# EAGLE design AJH_ss12144_01_4hp (EAGLE 9.5.2)
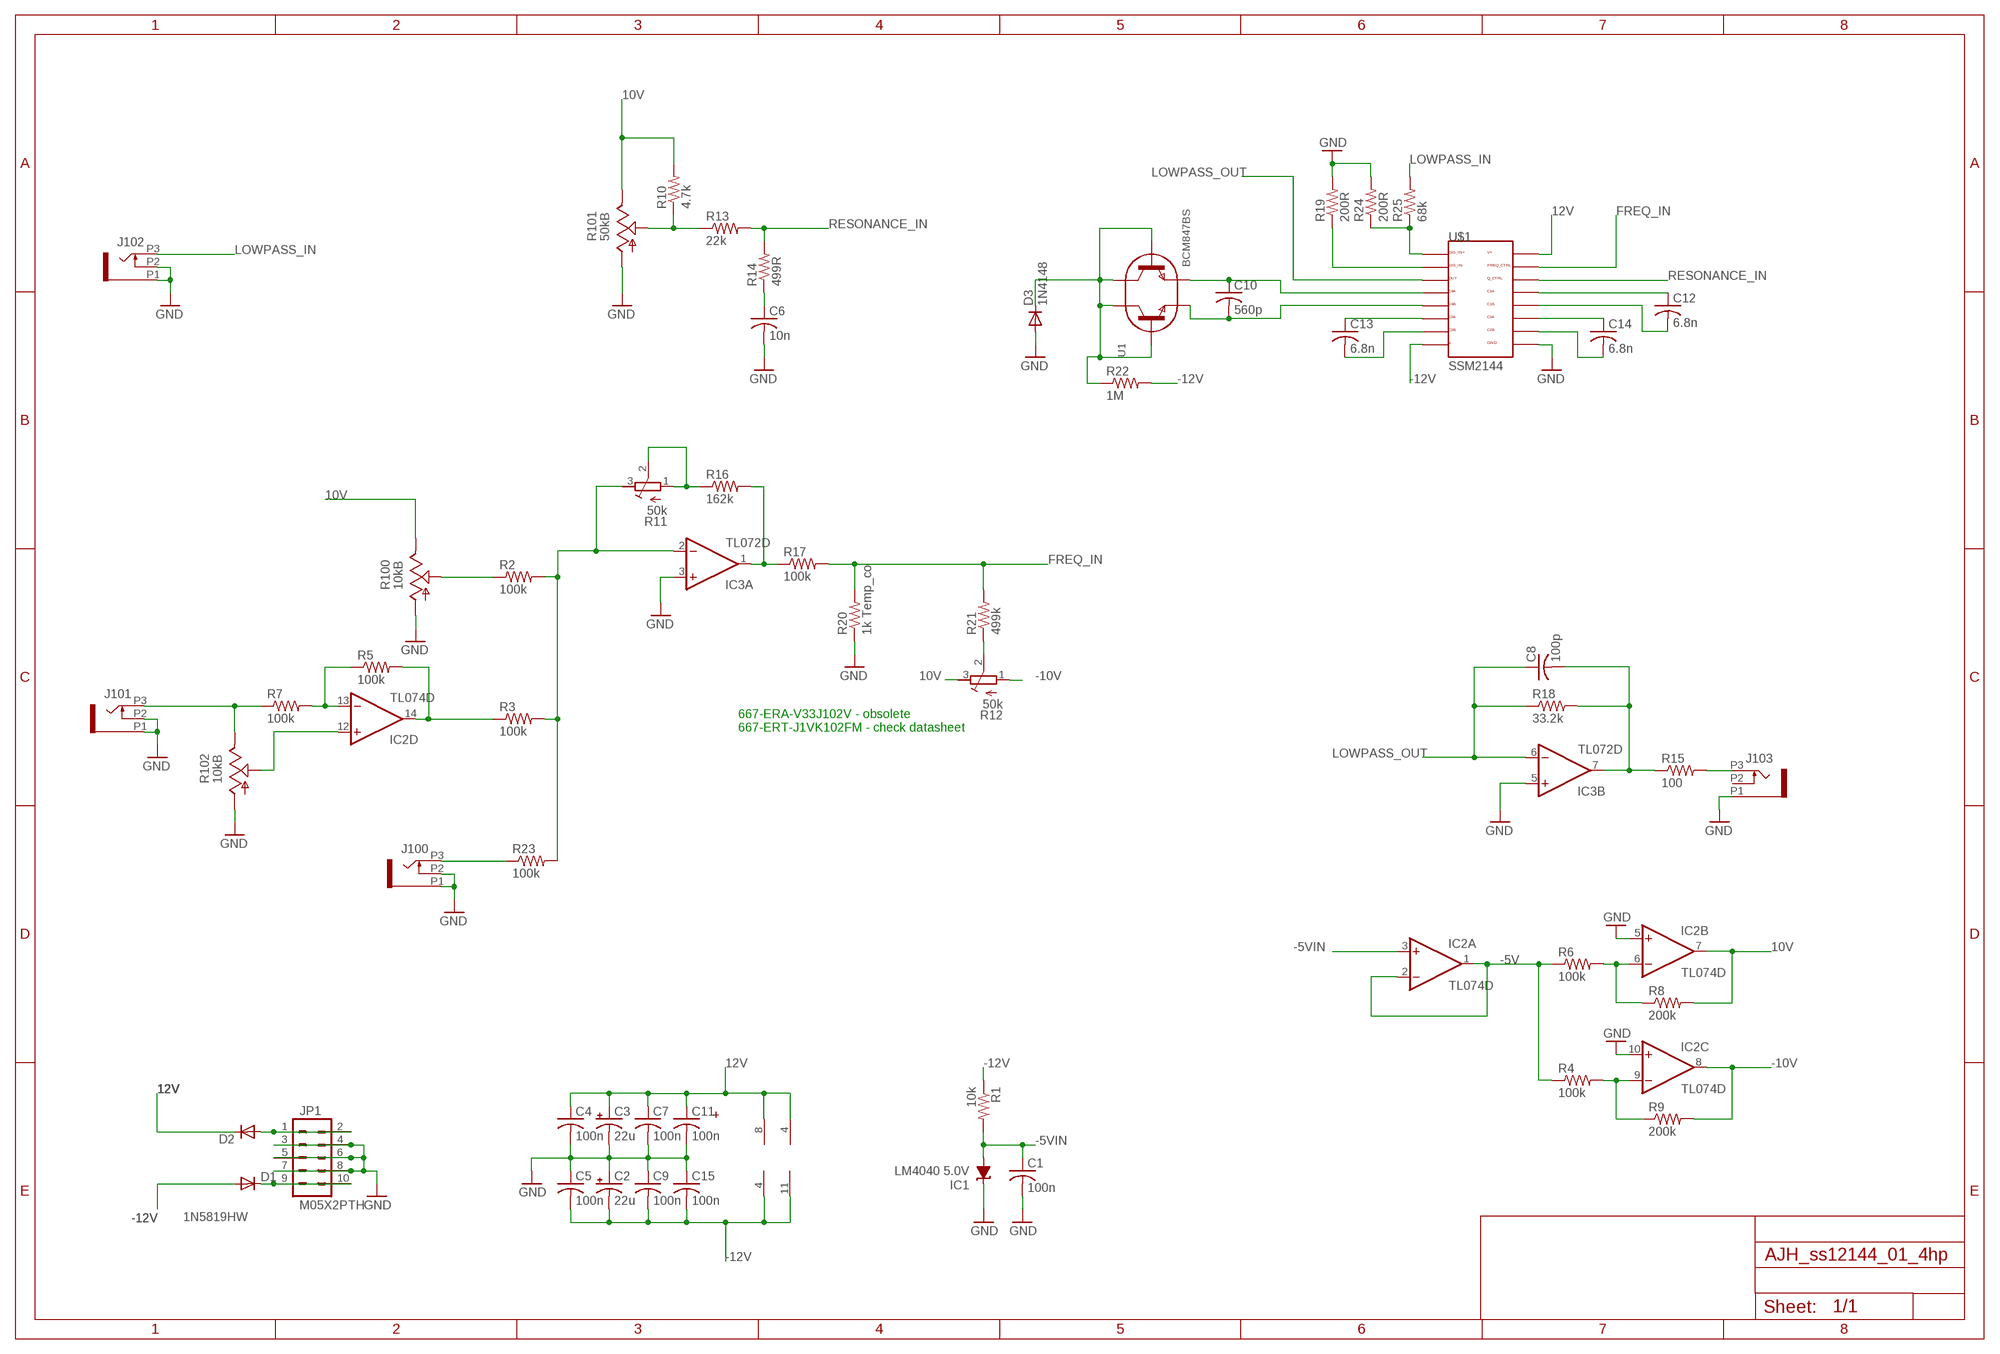
[diagram p0: schematic, sheet 1]

## Parts
C1  100n  C-USC0603  [C0603]
C2  22u  CPOL-USB  [PANASONIC_B]
C3  22u  CPOL-USB  [PANASONIC_B]
C4  100n  C-USC0603  [C0603]
C5  100n  C-USC0603  [C0603]
C6  10n  C-USC0603  [C0603]
C7  100n  C-USC0603  [C0603]
C8  100p  C-USC0603  [C0603]
C9  100n  C-USC0603  [C0603]
C10  560p  C-USC0603  [C0603]
C11  100n  C-USC0603  [C0603]
C12  6.8n  C-USC0603  [C0603]
C13  6.8n  C-USC0603  [C0603]
C14  6.8n  C-USC0603  [C0603]
C15  100n  C-USC0603  [C0603]
D1  1N5819HW  DIODE-SOD123  [SOD123]
D2  1N5819HW  DIODE-SOD123  [SOD123]
D3  1N4148  DIODE-SOD523  [SOD523]
IC1  LM4040 5.0V  LM4041C12DBZ  [DBZ_R-PDSO-G3]
IC2  TL074D  [SO14]
IC3  TL072D  [SO08]
J100  PJ301_THONKICONN6  [WQP_PJ_301M6]
J101  PJ301_THONKICONN6  [WQP_PJ_301M6]
J102  PJ301_THONKICONN6  [WQP_PJ_301M6]
J103  PJ301_THONKICONN6  [WQP_PJ_301M6]
JP1  M05X2PTH  [AVR_ICSP]
R1  10k  R-US_R0603  [R0603]
R2  100k  R-US_R0603  [R0603]
R3  100k  R-US_R0603  [R0603]
R4  100k  R-US_R0603  [R0603]
R5  100k  R-US_R0603  [R0603]
R6  100k  R-US_R0603  [R0603]
R7  100k  R-US_R0603  [R0603]
R8  200k  R-US_R0603  [R0603]
R9  200k  R-US_R0603  [R0603]
R10  4.7k  R-US_R0603  [R0603]
R11  50k  R-TRIMM3296X  [RTRIM3296X]
R12  50k  R-TRIMM3296X  [RTRIM3296X]
R13  22k  R-US_R0603  [R0603]
R14  499R  R-US_R0603  [R0603]
R15  100  R-US_R0603  [R0603]
R16  162k  R-US_R0603  [R0603]
R17  100k  R-US_R0603  [R0603]
R18  33.2k  R-US_R0603  [R0603]
R19  200R  R-US_R0603  [R0603]
R20  1k Temp_co  R-US_R0603  [R0603]
R21  499k  R-US_R0603  [R0603]
R22  1M  R-US_R0603  [R0603]
R23  100k  R-US_R0603  [R0603]
R24  200R  R-US_R0603  [R0603]
R25  68k  R-US_R0603  [R0603]
R100  10kB  POT_USVERTICAL  [ALPS_POT_VERTICAL]
R101  50kB  POT_USVERTICAL  [ALPS_POT_VERTICAL]
R102  10kB  POT_USVERTICAL  [ALPS_POT_VERTICAL]
U1  BCM847BS  [SOT363]
U$1  SSM2144  [SSOP16]

## Nets
10V [power]: IC2.7(B:OUT) R8.2 R10.2 R12.3(A) R100.P$1(E) R101.P$1(E)
12V [power]: C3.+ C4.1 C7.1 C11.1 D2.C IC2.4(P:V+) IC3.8(P:V+) U$1.16(V+)
-5V [power]: IC2.1(A:OUT) IC2.2(A:-IN) R4.1 R6.1
-5VIN [power]: C1.1 IC1.2(A) IC2.3(A:+IN) R1.2
-10V [power]: IC2.8(C:OUT) R9.2 R12.1(E)
-12V [power]: C2.- C5.2 C9.2 C15.2 D1.A IC2.11(P:V-) IC3.4(P:V-) R1.1 R22.2 U$1.8(V-)
FREQ_IN: R17.2 R20.2 R21.2 U$1.15(FREQ_CTRL)
GND [power]: C1.2 C2.+ C3.- C4.2 C5.1 C6.2 C7.2 C9.1 C11.2 C15.1 D3.A IC1.1(C) IC2.5(B:+IN) IC2.10(C:+IN) IC3.3(A:+IN) IC3.5(B:+IN) J100.P1 J100.P2 J101.P1 J101.P2 J102.P1 J102.P2 J103.P1 JP1.3 JP1.4 JP1.5 JP1.6 JP1.7 JP1.8 R19.2 R20.1 R24.2 R100.P$3(A) R101.P$3(A) R102.P$3(A) U$1.9(GND)
LOWPASS_IN: J102.P3 R25.2
LOWPASS_OUT: C8.1 IC3.6(B:-IN) R18.1 U$1.3(OUT)
N$1: C8.2 IC3.7(B:OUT) R15.1 R18.2
N$2: C13.1 U$1.6(C3A)
N$3: IC2.12(D:+IN) R102.P$2(S)
N$4: R2.1 R100.P$2(S)
N$5: IC2.13(D:-IN) R5.1 R7.2
N$6: D2.A JP1.1 JP1.2
N$7: IC3.2(A:-IN) R2.2 R3.2 R11.3(A) R23.2
N$8: IC3.1(A:OUT) R16.2 R17.1
N$9: C10.1 U1.4(E2) U$1.4(C4A)
N$10: J100.P3 R23.1
N$11: J103.P3 R15.2
N$12: IC2.14(D:OUT) R3.1 R5.2
N$13: IC2.9(C:-IN) R4.2 R9.1
N$14: D3.C R22.1 U1.2(B1) U1.3(C2) U1.5(B2) U1.6(C1)
N$15: IC2.6(B:-IN) R6.2 R8.1
N$16: C10.2 U1.1(E1) U$1.5(C4B)
N$17: C13.2 U$1.7(C3B)
N$18: C14.2 U$1.10(C2B)
N$19: C14.1 U$1.11(C2A)
N$20: D1.C JP1.9 JP1.10
N$21: C12.1 U$1.13(C1A)
N$23: C12.2 U$1.12(C1B)
N$24: R19.1 U$1.2(SIG_IN-)
N$25: R10.1 R13.1 R101.P$2(S)
N$26: C6.1 R14.1
N$27: R12.2(S) R21.1
N$28: R24.1 R25.1 U$1.1(SIG_IN+)
N$55: R11.1(E) R11.2(S) R16.1
N$82: J101.P3 R7.1 R102.P$1(E)
RESONANCE_IN: R13.2 R14.2 U$1.14(Q_CTRL)
Unconnected: J103.P2

## Notes on the sheet
- 667-ERA-V33J102V - obsolete
  667-ERT-J1VK102FM - check datasheet
- +

## Library data of the parts
C1 C4-C15 = rcl:C-US: CAPACITOR, American symbol
C2 C3 = rcl:CPOL-US: POLARIZED CAPACITOR, American symbol
D1-D3 = diode:DIODE-: DIODE
IC1 = texas:LM4041: PRECISION MICROPOWER SHUNT VOLTAGE REFERENCE Source: http://focus.ti.com/lit/ds/slcs146e/slcs146e.pdf
IC2 = linear:TL074: OP AMP
IC3 = linear:TL072: OP AMP
J100-J103 = og-pj301_variations:PJ301_THONKICONN
JP1 = og-header:M05X2: Header 5x2 Standard 10-pin dual row 0.1" header. Commonly used with AVR-ISP. Use with Spark Fun Electronics SKU: PRT-00778
R1-R10 R13-R25 = resistor:R-US_: RESISTOR, American symbol
R11 R12 = rcl:R-TRIMM: Trimm resistor
R100-R102 = og-pots:POT_US
U1 = Jeff Custom Components:BCM847BS
U$1 = AJHParts:SSM2144

## Net classes
1 power: width 0.406 mm
2 nearfilter: width 0.152 mm

## Board
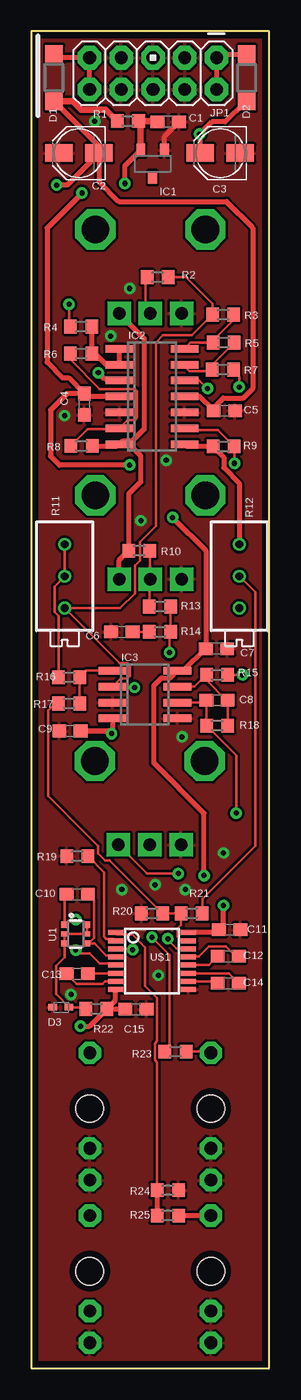
[diagram p1: board, top side]
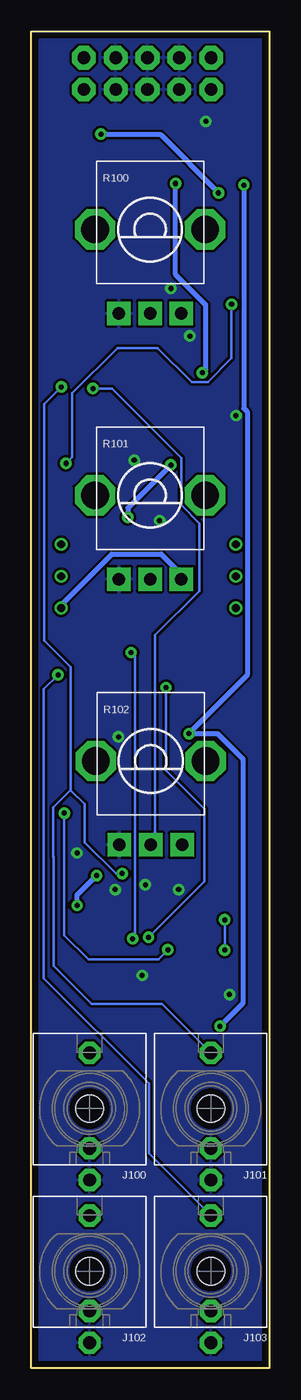
[diagram p2: board, bottom side, seen from below]

Size 19.03 x 106.76 mm. Coordinates in mm from the lower left corner, seen from the top.
Outline: 0,0 19.03,0 19.03,106.76 0,106.76 0,0
Copper layers (1*16): Top 0.035mm / dielectric 1.5mm / Bottom 0.035mm
Design rules "Mutable_PCBCart-Standard": minimum track width 8mil, minimum drill 0.4mm, track to track 8mil, track to pad 8mil, pad to pad 8mil, via to via 8mil, smd to smd 8mil, copper to edge 20mil, drill to drill 8mil, minimum pad ring 8mil, minimum via ring 10mil, stop-mask expansion 3mil, vias tented up to drill 25mil, thermal gap 8mil

### Footprints (pad centres in the part's own frame; a part is rotated, then mirrored left to right if it is on the bottom)
C0603 = smd 1.1 x 1: 1 -0.85,0; 2 0.85,0
PANASONIC_B = smd 2.2 x 1.4: + 1.6,0; - -1.6,0
SOD123 = smd 1.4 x 1.4: A 1.9,0; C -1.9,0
SOD523 = smd 0.7 x 0.5: A 0.7,0; C -0.6,0
DBZ_R-PDSO-G3 = smd 0.7 x 1: 1 -0.95,-1.1; 2 0.95,-1.1; 3 0,1.1
SO14 = smd 0.6 x 2.2: 1 -3.81,-2.6; 2 -2.54,-2.6; 3 -1.27,-2.6; 4 0,-2.6; 5 1.27,-2.6; 6 2.54,-2.6; 7 3.81,-2.6; 8 3.81,2.6; 9 2.54,2.6; 10 1.27,2.6; 11 0,2.6; 12 -1.27,2.6; 13 -2.54,2.6; 14 -3.81,2.6
SO08 = smd 0.6 x 2.2: 1 -1.905,-2.6; 2 -0.635,-2.6; 3 0.635,-2.6; 4 1.905,-2.6; 5 1.905,2.6; 6 0.635,2.6; 7 -0.635,2.6; 8 -1.905,2.6
WQP_PJ_301M6 = drill 1.016 pad 1.778 octagon: P1 0,-5.715; P2 0,-3.175; P3 0,4.445 | hole 2.2: 0,0
AVR_ICSP = drill 1.016 pad 1.88 octagon: 1 -1.27,5.08; 2 1.27,5.08; 3 -1.27,2.54; 4 1.27,2.54; 5 -1.27,0; 6 1.27,0; 7 -1.27,-2.54; 8 1.27,-2.54; 9 -1.27,-5.08; 10 1.27,-5.08
R0603 = smd 1 x 1.1: 1 -0.85,0; 2 0.85,0
RTRIM3296X = drill 0.61: 1 0,-2.54; 2 0,0; 3 0,2.54
ALPS_POT_VERTICAL = drill 1 pad 1.88 square: P$1 -2.5,6.7; P$2 0,6.7; P$3 2.5,6.7 | drill 2.2 pad 3.175 octagon: P$4 -4.4,0; P$5 4.4,0
SOT363 = smd 0.5 x 0.5: 1 -0.75,-0.9; 3 0.75,-0.9; 4 0.75,0.9; 6 -0.75,0.9 | smd 0.4 x 0.5: 2 0,-0.9; 5 0,0.9
SSOP16 = smd 0.4 x 1.2: 1 -2.275,-2.925; 2 -1.625,-2.925; 3 -0.975,-2.925; 4 -0.325,-2.925; 5 0.325,-2.925; 6 0.975,-2.925; 7 1.625,-2.925; 8 2.275,-2.925; 9 2.275,2.925; 10 1.625,2.925; 11 0.975,2.925; 12 0.325,2.925; 13 -0.325,2.925; 14 -0.975,2.925; 15 -1.625,2.925; 16 -2.275,2.925

### Placement (x,y rotation side)
C1  10.95,99.53 0 top
C2  3.81,97.03 180 top
C3  15.11,97.03 180 top
C4  4.24,76.98 270 top
C5  15.44,76.46 180 top
C6  7.24,58.8 180 top
C7  14.81,57.47 0 top
C8  14.86,53.34 0 top
C9  3.1,50.88 0 top
C10  3.68,37.85 180 top
C11  15.86,35.01 0 top
C12  15.75,32.89 180 top
C13  3.68,31.5 180 top
C14  15.75,30.73 180 top
C15  8.37,28.66 180 top
D1  1.83,103.06 270 top
D2  17.23,103.04 90 top
D3  2.41,28.83 180 top
IC1  9.7,96.17 180 top
IC2  9.65,77.6 270 top
IC3  9.09,53.79 270 top
J100  14.37,20.74 0 bottom
J101  4.67,20.74 0 bottom
J102  14.37,7.75 0 bottom
J103  4.67,7.75 0 bottom
JP1  9.74,103.38 270 top
R1  7.73,99.59 0 top
R2  10.11,87.13 0 top
R3  15.35,84.13 180 top
R4  3.98,83.17 180 top
R5  15.38,81.9 180 top
R6  3.98,81.03 180 top
R7  15.32,79.75 180 top
R8  4.02,73.65 0 top
R9  15.39,73.61 180 top
R10  8.64,65.28 180 top
R11  2.67,63.25 180 top
R12  16.64,63.25 180 top
R13  10.29,60.83 0 top
R14  10.29,58.8 0 top
R15  14.86,55.37 0 top
R16  3.02,55.17 0 top
R17  3.02,53.09 180 top
R18  14.86,51.31 0 top
R19  3.68,40.89 180 top
R20  9.65,36.32 0 top
R21  12.83,36.32 180 top
R22  5.21,28.7 0 top
R23  11.53,25.28 180 top
R24  10.92,14.22 0 top
R25  10.92,12.19 0 top
R100  9.53,90.93 180 bottom
R101  9.53,69.71 180 bottom
R102  9.47,48.49 180 bottom
U1  3.56,34.67 270 top
U$1  9.65,32.51 270 top

### Tracks (layer width: path | path; a pad name or v marks a point on that pad's centre or on a via)
10V
  Top 0.406: R8.2 6.92,73.65 IC2.7 | R100.P$1 9.02,82.23 9.02,74.99 8.04,74.02 7.29,74.02 IC2.7 | R101.P$1 7.03,64.52 R10.2 7.79,69.81 8.74,70.76 8.74,72.86 7.81,73.79 IC2.7
  Bottom 0.406: R101.P$1 7.03,63.39 8.66,65.02 12.57,65.02 16.64,60.96 R12.3
12V  (via drill 0.4, 0.41)
  Top 0.406: D2.C 17.1,101.14 15.49,99.54 14.45,99.54 v13.46,98.55 13.51,98.5 C3.+ | C4.1 2.97,79.1 2.49,79.1 1.26,80.33 1.26,91.05 v4.06,93.85 | v7.87,72.14 7.85,72.11 2.27,72.11 1.55,72.83 1.55,76.51 2.87,77.83 C4.1 | v11.3,67.94 13.96,65.29 C7.1 12.19,55.7 IC3.8 11.13,55.13 10.42,55.13 9.8,54.51 9.8,48.31 13.81,44.31 v13.81,39.34 | IC2.4 4.48,77.6 C4.1 | v15.37,36.96 15.37,35.37 C11.1 14.8,34.8 U$1.16
  Bottom 0.406: v4.06,93.85 4.06,93.88 8.71,98.52 13.43,98.52 v13.46,98.55 | v11.3,67.94 11.3,68.71 v7.87,72.14 | v15.37,36.96 15.37,37.79 v13.81,39.34
-5V
  Top 0.406: IC2.1 IC2.2 5.98,80.14 5.09,81.03 R6.1 R4.1
-5VIN  (via drill 0.41)
  Top 0.406: IC2.3 6.92,78.99 5.87,78.99 v5.36,79.5 | v7.49,94.61 7.49,96.02 IC1.2
  Top 0.508: C1.1 10.04,99.59 R1.2 8.75,99.42 IC1.2
  Bottom 0.406: v5.36,79.5 5.09,79.77 5.09,84.94 7.49,87.34 v7.49,94.61
-10V
  Top 0.406: IC2.8 12.43,73.61 R9.2 15.39,72.75 15.39,71.91 16.64,70.66 R12.1
-12V  (via drill 0.4)
  Top 0.406: IC2.11 13.45,77.6 C5.2 14.59,76.71 15.35,77.47 16.98,77.47 17.72,78.22 17.72,91.06 15.62,93.16 6.99,93.16 5.41,94.74 C2.- | IC3.4 6.49,50.88 C9.2 6.21,50.88 v6.42,50.67 | D1.A 5.41,97.58 C2.- | C2.- 2.87,94.49 v2.03,94.49 | v3.94,27.3 4.66,27.3 R22.2 | R22.2 7.47,28.7 C15.2 | R22.2 6.73,29.37 U$1.8
  Top 0.508: D1.A 3.32,101.16 3.97,100.51 5.96,100.51 R1.1
  Bottom 0.406: v2.03,94.49 2.03,76.66 1.75,76.38 1.75,55.34 v6.42,50.67 4.13,50.67 2.1,48.64 2.1,29.14 v3.94,27.3
FREQ_IN
  Top 0.203: R17.2 1.92,53.09 1.34,52.51 1.34,45.7 5.34,41.7 5.34,41.12 5.91,40.55 6.28,40.55 R20.2 11.85,36.32 11.98,36.2 | 11.98,36.2 11.98,35.42 11.67,35.11 11.67,34.46 12,34.14 U$1.15 | 11.98,36.2 R21.2
GND  (via drill 0.4, 0.41)
  Top 0.406: IC1.1 10.65,98.38 C1.2
  other vias: 10.79,72.52 2.67,76.07 6.35,82.42 7.87,86.23 5.08,99.57 12.32,38.23 9.91,38.61 7.24,38.23 15.37,41.15 12.06,50.42 3.17,29.84 10.16,31.37 8.76,67.69
  pour Top: -0.89,107.7 19.43,107.7 20.07,107.06 20.32,106.81 20.32,-0.25 19.3,-1.27 -0.25,-1.27 -0.89,-0.64
  pour Bottom: -1.4,108.33 20.07,108.33 20.07,-0.64 -1.14,-0.64 -1.4,-0.38
LOWPASS_IN
  Top 0.406: R25.2 J102.P3
LOWPASS_OUT  (via drill 0.4)
  Top 0.203: IC3.6 13.83,53.16 C8.1 R18.1 16.38,48.93 v16.38,44.32 | U$1.3 6.75,33.47 8.06,33.47 v8.11,33.42
  Bottom 0.203: v16.38,44.32 16.38,34.58 14.46,32.66 8.87,32.66 v8.11,33.42
N$1
  Top 0.203: R18.2 C8.2 15.62,53.34 14.01,54.95 R15.1 13.06,54.43 IC3.7
N$2
  Top 0.203: C13.1 4.57,31.54 U$1.6
N$3  (via drill 0.41)
  Top 0.203: IC2.12 13.46,78.87 v14.1,78.23
  Bottom 0.203: v14.1,78.23 12.57,78.23 7.04,72.7 7.04,68.92 5.59,67.47 5.59,62.08 9.13,58.54 9.13,42.13 R102.P$2
N$4
  Top 0.203: R2.1 9.14,87.02 9.14,84.61 R100.P$2
N$5
  Top 0.203: R5.1 14.47,80.15 R7.2 14.35,79.62 12.64,79.62 12.25,80.01 IC2.13
N$6
  Top 0.406: JP1.2 JP1.1 15.11,104.94 D2.A
N$7  (via drill 0.4)
  Top 0.203: R23.2 10.68,25.54 11.06,25.92 11.06,33.01 v9.65,34.42 | v8.26,54.36 8.2,54.3 6.73,54.3 6.6,54.43 IC3.2 7.16,55.09 7.72,55.09 7.9,55.27 7.9,56.12 7.72,56.3 7.07,56.3 R11.3 7.11,60.71 8.28,61.87 8.28,64.08 8.68,64.48 8.68,65.95 9.98,67.25 9.98,81.91 10.55,82.48 12.84,82.48 14.48,84.13 R3.2 14.49,85.02 12.38,87.13 R2.2
  Bottom 0.203: v9.65,34.42 5.18,38.89 5.18,44.68 8.26,47.75 v8.26,54.36
N$8
  Top 0.203: R17.1 R16.2 4.39,55.7 IC3.1
N$9
  Top 0.203: U$1.4 6.58,32.98 6,32.98 5.06,33.92 4.7,33.92 | U1.4 4.7,33.92 | 4.7,33.92 4.7,34.03 5.01,34.34 5.01,37.37 C10.1
N$10
  Top 0.203: R23.1 14.27,25.28 J100.P3
N$11  (via drill 0.41)
  Top 0.203: R15.2 v16.89,55.37
  Bottom 0.203: v16.89,55.37 18.03,54.23 18.03,31.14 9.63,22.73 9.63,17.14 J103.P3
N$12
  Top 0.203: IC2.14 12.74,81.9 R5.2 14.53,82.08 16.2,83.75 R3.1
N$13  (via drill 0.41)
  Top 0.203: IC2.9 12.38,74.93 14.92,74.93 R9.1 16.26,73.59 v16.26,72.26 | v3.01,84.96 3.01,83.29 R4.2
  Bottom 0.203: v16.26,72.26 15.75,72.77 15.75,77.86 12.13,81.47 8.92,81.47 6.18,78.74 4.92,78.74 3.01,80.64 v3.01,84.96
N$14
  Top 0.203: D3.C 3.05,28.83 | 3.05,28.83 4.23,28.83 R22.1 | U1.6 U1.5 U1.2 U1.3 2.66,32.8 1.98,32.12 1.98,29.9 3.05,28.83
N$15
  Top 0.203: R8.1 4.51,75 7.05,75 IC2.6 7.72,75.72 8.28,75.72 8.46,75.9 8.46,78.02 8.28,78.2 5.46,78.2 3.13,80.52 R6.2
N$16  (via drill 0.4)
  Top 0.203: U$1.5 6.58,32.33 5.46,32.33 4.66,33.14 3.81,33.14 v3.56,33.39 | C10.2 2.66,37.67 U1.1 3.05,35.81 v3.56,35.81
  Bottom 0.203: v3.56,35.81 v3.56,33.39
N$17
  Top 0.203: U$1.7 5.91,30.89 5.72,30.69 3.64,30.69 C13.2
N$18
  Top 0.203: U$1.10 14.74,30.89 C14.2
N$19
  Top 0.203: U$1.11 14.22,31.54 15.79,31.54 C14.1
N$20
  Top 0.406: D1.C 2.14,104.65 JP1.9 JP1.10
N$21
  Top 0.203: U$1.13 12.63,32.89 13.42,32.89 14.22,33.7 15.57,33.7 16.38,32.89 C12.1
N$23
  Top 0.203: C12.2 14.19,32.19 U$1.12
N$24
  Top 0.203: R19.1 5.82,39.6 5.82,34.46 6,34.28 6.58,34.28 U$1.2
N$25
  Top 0.203: R10.1 9.49,63.05 R101.P$2 9.44,62.92 R13.1
N$26
  Top 0.203: C6.1 R14.1
N$27
  Top 0.203: R12.2 17.91,61.98 17.91,41.7 13.68,37.47 R21.1
N$28
  Top 0.203: U$1.1 6.87,34.64 8.09,34.64 9.11,33.62 9.11,30.51 10.07,29.55 10.07,26.15 9.88,25.96 9.88,24.61 10.07,24.41 R24.1
  Top 0.406: R24.1 R25.1
N$55
  Top 0.203: R11.1 R11.2 1.85,62.43 1.85,60.37 2.17,60.05 R16.1
N$82  (via drill 0.4, 0.41)
  Top 0.203: R7.1 16.18,79.62 16.64,79.16 v16.64,78.36 | R102.P$1 9.27,39.5 v11.76,39.5
  Bottom 0.203: v16.64,78.36 17.99,77.01 17.99,58.12 15.88,56.01 15.88,46.16 | J101.P3 8.57,29.08 14.19,29.08 17.25,32.15 17.25,40.82 17.27,40.83 17.27,44.76 15.88,46.16 | v11.76,39.5 12.27,39.5 14.77,42 14.77,45.05 15.88,46.16
RESONANCE_IN  (via drill 0.4)
  Top 0.203: R13.2 R14.2 11.05,58.71 v11.05,57.15 | U$1.14 12.56,33.51 11.6,33.51 10.91,34.19 v10.91,34.29
  Bottom 0.203: v11.05,57.15 10.73,56.83 10.73,34.47 v10.91,34.29

### Text on the board
tDocu: ssi2144 lpf v1.0, copyright forestcaver 2020